# EAGLE design T102 (EAGLE 7.7.0)
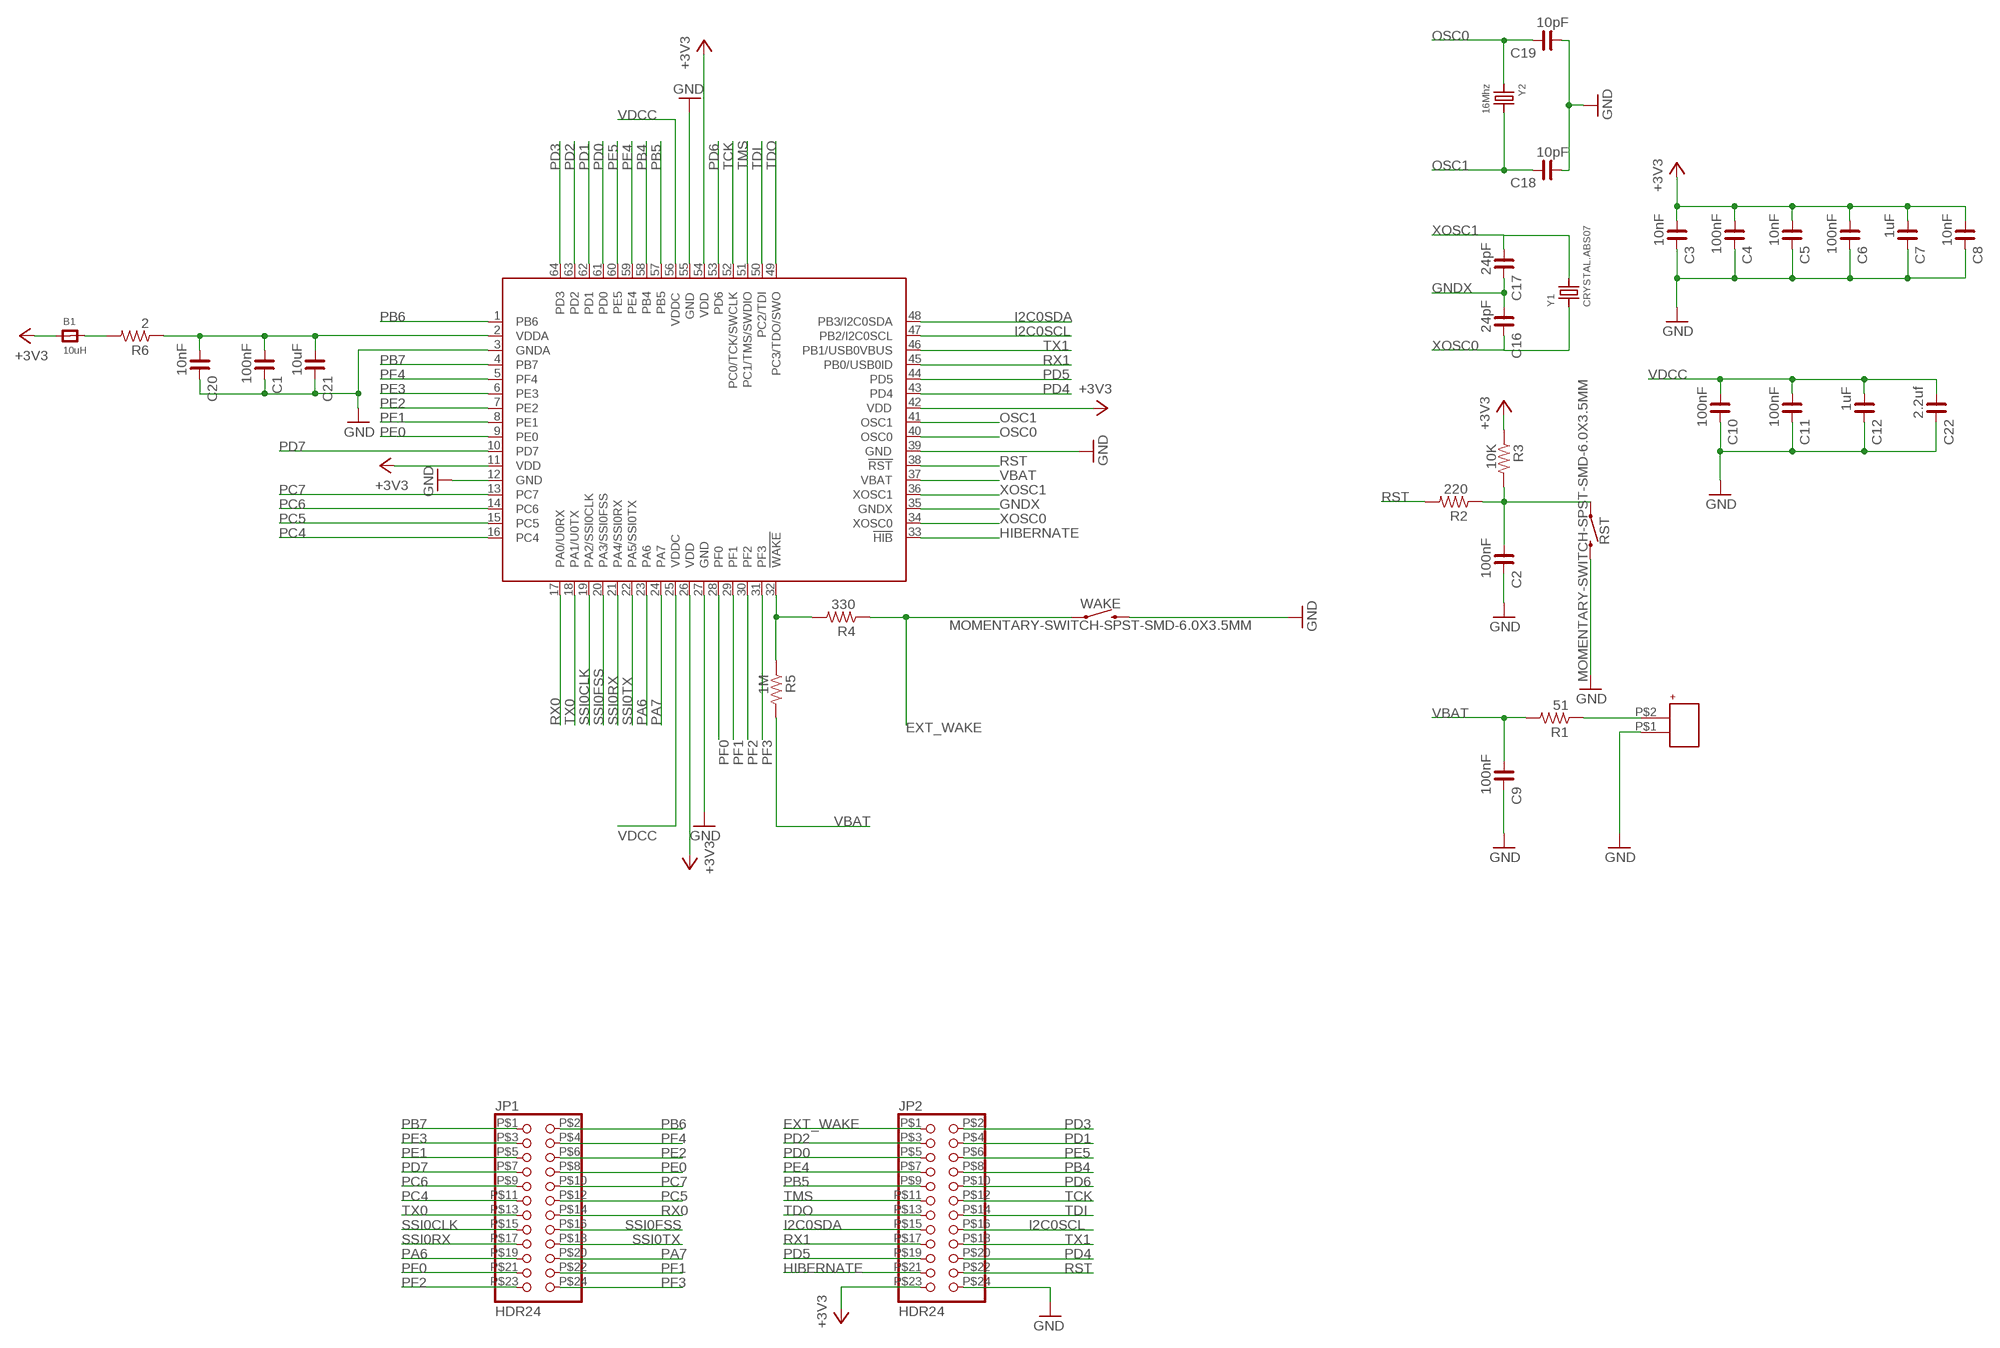
[diagram p0: schematic, sheet 1]

## Parts
B1  10uH  FERRITE_0603  [_0603]
C1  100nF  C_0402  [C0402]
C2  100nF  C_0402  [C0402]
C3  10nF  C_0402  [C0402]
C4  100nF  C_0402  [C0402]
C5  10nF  C_0402  [C0402]
C6  100nF  C_0402  [C0402]
C7  1uF  C_0402  [C0402]
C8  10nF  C_0402  [C0402]
C9  100nF  C_0402  [C0402]
C10  100nF  C_0402  [C0402]
C11  100nF  C_0402  [C0402]
C12  1uF  C_0402  [C0402]
C16  24pF  C_0402  [C0402]
C17  24pF  C_0402  [C0402]
C18  10pF  C_0402  [C0402]
C19  10pF  C_0402  [C0402]
C20  10nF  C_0402  [C0402]
C21  10uF  C_0603  [C0603]
C22  2.2uf  C_0603  [C0603]
IC1  TM4C123[7,G]XXPM  [PM_S-PQFP-G64]
JP1  HDR24  [HDR24]
JP2  HDR24  [HDR24]
R1  51  R_0402  [R0402]
R2  220  R_0402  [R0402]
R3  10K  R_0402  [R0402]
R4  330  R_0402  [R0402]
R5  1M  R_0402  [R0402]
R6  2  R_0402  [R0402]
RST  MOMENTARY-SWITCH-SPST-SMD-6.0X3.5MM  [TACTILE_SWITCH_SMD_6.0X3.5MM]
U$1  JST-MICROBAT  [JST-MICROBAT]
WAKE  MOMENTARY-SWITCH-SPST-SMD-6.0X3.5MM  [TACTILE_SWITCH_SMD_6.0X3.5MM]
Y1  CRYSTAL.ABS07  [ABS07]
Y2  16Mhz  CRYSTAL.6X3.3MM  [6X3.3MM]

## Nets
+3V3: B1.1 C3.1 C4.1 C5.1 C6.1 C7.1 C8.1 IC1.11(VDD) IC1.26(VDD) IC1.42(VDD) IC1.54(VDD) JP2.P$23 R3.1
EXT_WAKE: JP2.P$1 R4.1 WAKE.1
GND: C1.2 C2.2 C3.2 C4.2 C5.2 C6.2 C7.2 C8.2 C9.2 C10.2 C11.2 C12.2 C18.1 C19.1 C20.2 C21.2 C22.2 IC1.3(GNDA) IC1.12(GND) IC1.27(GND) IC1.39(GND) IC1.55(GND) JP2.P$24 RST.2 U$1.P$1 WAKE.2
GNDX: C16.1 C17.2 IC1.35(GNDX)
HIBERNATE: IC1.33(!HIB) JP2.P$21
I2C0SCL: IC1.47(PB2/I2C0SCL) JP2.P$16
I2C0SDA: IC1.48(PB3/I2C0SDA) JP2.P$15
N$1: R1.1 U$1.P$2
N$4: C2.1 R2.1 R3.2 RST.1
N$23: C1.1 C20.1 C21.1 IC1.2(VDDA) R6.1
N$31: B1.2 R6.2
N_WAKE: IC1.32(!WAKE) R4.2 R5.1
OSC0: C19.2 IC1.40(OSC0) Y2.1
OSC1: C18.2 IC1.41(OSC1) Y2.2
PA6: IC1.23(PA6) JP1.P$19
PA7: IC1.24(PA7) JP1.P$20
PB4: IC1.58(PB4) JP2.P$8
PB5: IC1.57(PB5) JP2.P$9
PB6: IC1.1(PB6) JP1.P$2
PB7: IC1.4(PB7) JP1.P$1
PC4: IC1.16(PC4) JP1.P$11
PC5: IC1.15(PC5) JP1.P$12
PC6: IC1.14(PC6) JP1.P$9
PC7: IC1.13(PC7) JP1.P$10
PD0: IC1.61(PD0) JP2.P$5
PD1: IC1.62(PD1) JP2.P$4
PD2: IC1.63(PD2) JP2.P$3
PD3: IC1.64(PD3) JP2.P$2
PD4: IC1.43(PD4) JP2.P$20
PD5: IC1.44(PD5) JP2.P$19
PD6: IC1.53(PD6) JP2.P$10
PD7: IC1.10(PD7) JP1.P$7
PE0: IC1.9(PE0) JP1.P$8
PE1: IC1.8(PE1) JP1.P$5
PE2: IC1.7(PE2) JP1.P$6
PE3: IC1.6(PE3) JP1.P$3
PE4: IC1.59(PE4) JP2.P$7
PE5: IC1.60(PE5) JP2.P$6
PF0: IC1.28(PF0) JP1.P$21
PF1: IC1.29(PF1) JP1.P$22
PF2: IC1.30(PF2) JP1.P$23
PF3: IC1.31(PF3) JP1.P$24
PF4: IC1.5(PF4) JP1.P$4
RST: IC1.38(!RST) JP2.P$22 R2.2
RX0: IC1.17(PA0/U0RX) JP1.P$14
RX1: IC1.45(PB0/USB0ID) JP2.P$17
SSI0CLK: IC1.19(PA2/SSI0CLK) JP1.P$15
SSI0FSS: IC1.20(PA3/SSI0FSS) JP1.P$16
SSI0RX: IC1.21(PA4/SSI0RX) JP1.P$17
SSI0TX: IC1.22(PA5/SSI0TX) JP1.P$18
TCK: IC1.52(PC0/TCK/SWCLK) JP2.P$12
TDI: IC1.50(PC2/TDI) JP2.P$14
TDO: IC1.49(PC3/TDO/SWO) JP2.P$13
TMS: IC1.51(PC1/TMS/SWDIO) JP2.P$11
TX0: IC1.18(PA1/U0TX) JP1.P$13
TX1: IC1.46(PB1/USB0VBUS) JP2.P$18
VBAT: C9.1 IC1.37(VBAT) R1.2 R5.2
VDCC: C10.1 C11.1 C12.1 C22.1 IC1.25(VDDC) IC1.56(VDDC)
XOSC0: C16.2 IC1.34(XOSC0) Y1.1
XOSC1: C17.1 IC1.36(XOSC1) Y1.2

## Library data of the parts
B1 = microbuilder:FERRITE: Ferrite Bead 0603 MMZ1608B121C - 120 Ohm @ 100MHz, 600mA, 0.15 Ohm DC Resistance - Digikey: 445-2164-1-ND BK1608HW121-T - 120 Ohm, 600mA Ferrite Chip - Digikey: 587-1876-2-ND 0805 HZ0805B272R-10 - 2.7K Ohm @ 100MHz, 200mA, 0.8 Ohm DC Resistance - Digikey: 240-2504-1-ND (see also Murata BLM21BD272SN1L) MMZ2012Y152B - 1.5K Ohm @ 100MHz, 500mA, 0.4 Ohm DC Resistance - Digikey: 445-1560-1-ND - Mainly for high frequency (80-400MHz) MMZ2012R102A - 1K Ohm @ 100MHz, 500mA, 0.3 Ohm DC Resistance - Digikey: 445-1555-2-ND - More general purpose (10-200MHz)
C1-C12 C16-C22 = rc-master-smd:C_: NON-POLARIZED CAP
IC1 = ti-tiva:TM4C123[7,G]XX
JP1 JP2 = EAGLE_CAN:HDR24
R1-R6 = rc-master-smd:R_: RESISTOR
RST WAKE = SparkFun-Switches:MOMENTARY-SWITCH-SPST: Momentary Switch (Pushbutton) - SPST Normally-open (NO) SPST momentary switches (buttons, pushbuttons). Variants PTH-12MM - 12mm square, through-hole Momentary Pushbutton Switch - 12mm Square <https://www.sparkfun.com/products/9190> (COM-09190) PTH-6.0MM, PTH-6.0MM-KIT - 6.0mm square, through-hole Mini Pushbutton Switch <https://www.sparkfun.com/products/97> (COM-00097) KIT package intended for soldering kit's - only one side of pads' copper is exposed. PTH-RIGHT-ANGLE-KIT - Right-angle, through-hole Right Angle Tactile Button <https://www.sparkfun.com/products/10791> - Used on SparkFun BigTime Watch Kit <https://www.sparkfun.com/products/11734> SMD-12MM - 12mm square, surface-mount Tactile Button - SMD (12mm) <https://www.sparkfun.com/products/12993> (COM-12993) Used on SparkFun PicoBoard <https://www.sparkfun.com/products/11888> SMD-4.5MM - 4.5mm Square Trackball Switch Used on SparkFun Blackberry Trackballer Breakout <https://www.sparkfun.com/products/13169> SMD-4.6MMX2.8MM - 4.60mm x 2.80mm, surface mount Used on SparkFun SAMD21 Mini Breakout <https://www.sparkfun.com/products/13664> SMD-5.2MM, SMD-5.2-REDUNDANT - 5.2mm square, surface-mount Mini Pushbutton Switch - SMD <https://www.sparkfun.com/products/8720> (COM-08720) Used on Arduino Pro Mini <https://www.sparkfun.com/products/11114> REDUNDANT package connects both switch circuits together SMD-6.0X3.5MM - 6.0 x 3.5mm, surface mount Momentary Reset Switch SMD <https://www.sparkfun.com/products/8229> (COM-08229) SMD-6.2MM-TALL - 6.2mm square, surface mount Tactile Button - SMD (6mm) <https://www.sparkfun.com/products/12992> Used on SparkFun Digital Sandbox <https://www.sparkfun.com/products/12651> SMD-RIGHT-ANGLE - Right-angle, surface mount Used on SparkFun Block for Intel® Edison - Arduino <https://www.sparkfun.com/products/13036>; PROD_ID: SWCH-00815; SF_SKU: COM-08229
U$1 = EAGLE_CAN:JST-MICROBAT
Y1 Y2 = abracon:CRYSTAL

## Board
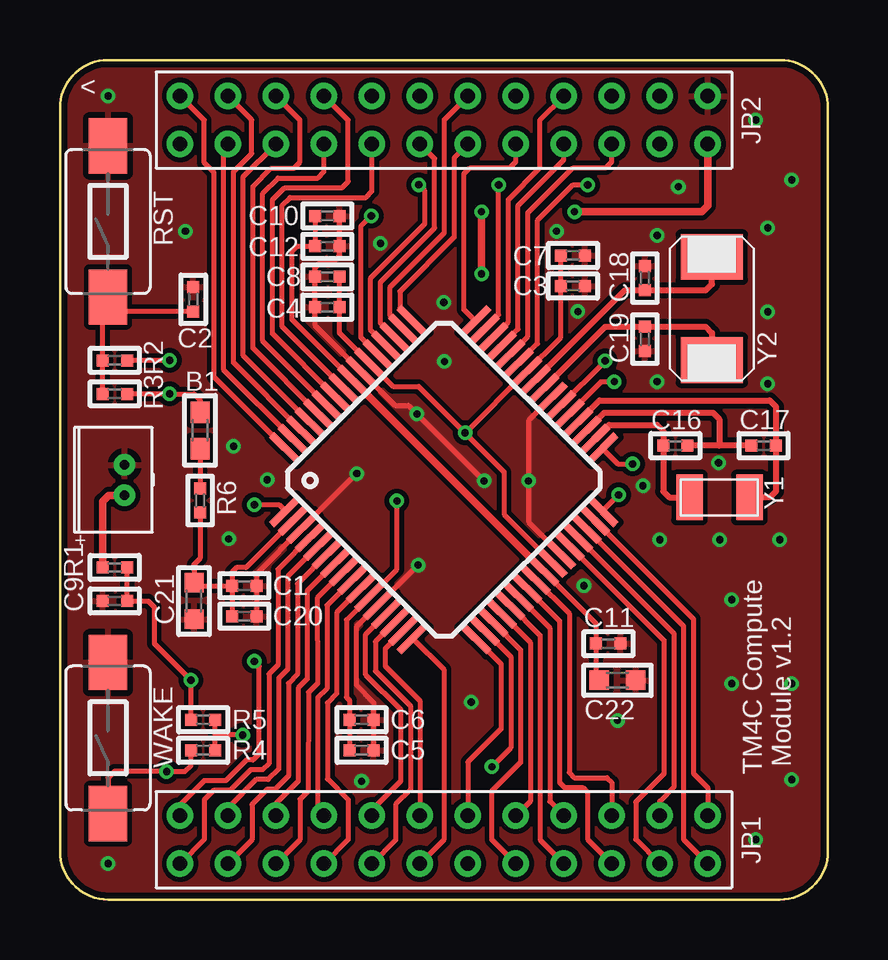
[diagram p1: board, top side]
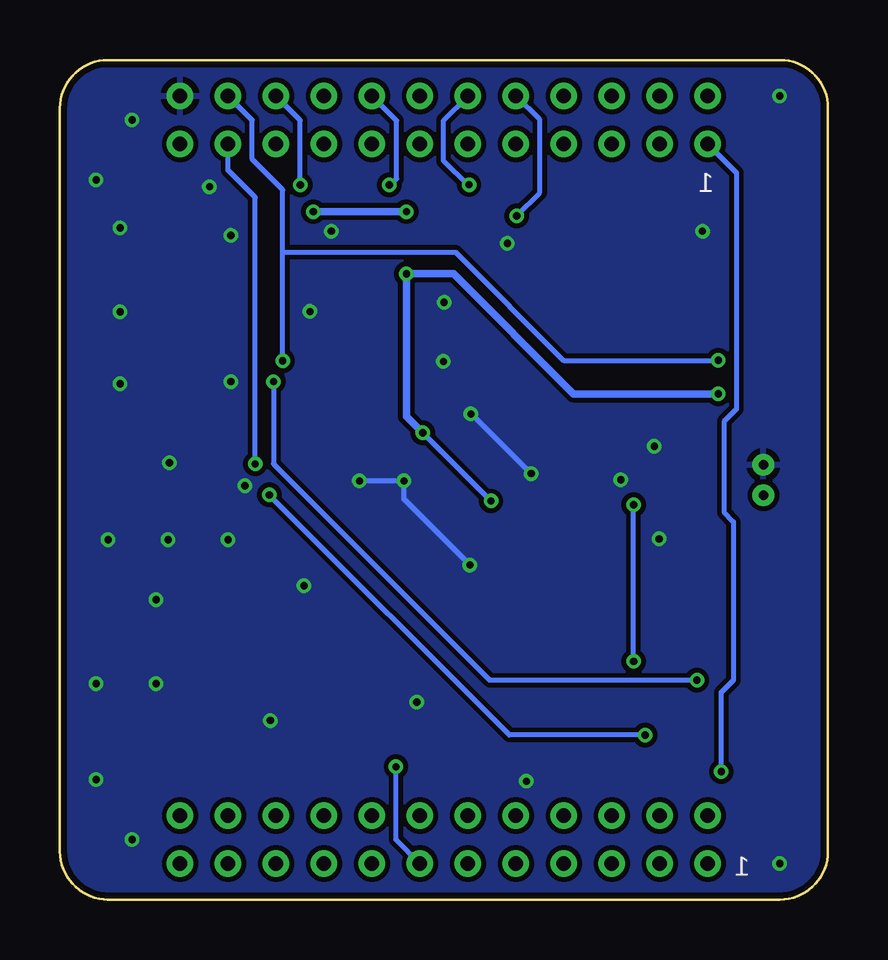
[diagram p2: board, bottom side, seen from below]

Size 32.02 x 35 mm. Coordinates in mm from the lower left corner, seen from the top.
Outline: 0,2 0,33 arc-90 2,35 30.02,35 arc-90 32.02,33 32.02,2 arc-90 30.02,0 2,0 arc-90 0,2
Copper layers (1*16): Top 0.035mm / dielectric 1.5mm / Bottom 0.035mm
Design rules "SeeedStudio_2layer_DRU_no_angle_20140221 *": minimum track width 6mil, minimum drill 12mil, track to track 6mil, track to pad 6mil, pad to pad 6mil, via to via 6mil, smd to smd 0mil, copper to edge 10mil, drill to drill 10mil, minimum pad ring 10mil, minimum via ring 6mil, stop-mask expansion 2mil, vias tented up to drill 12mil, thermal gap 10mil

### Footprints (pad centres in the part's own frame; a part is rotated, then mirrored left to right if it is on the bottom)
_0603 = smd 0.9 x 0.8: 1 -0.762,0; 2 0.762,0
C0402 = smd 0.5 x 0.5: 1 -0.508,0; 2 0.508,0
C0603 = smd 0.8 x 0.8: 1 -0.762,0; 2 0.762,0
PM_S-PQFP-G64 = smd 1.6 x 0.3: 1 -5.6,3.75; 2 -5.6,3.25; 3 -5.6,2.75; 4 -5.6,2.25; 5 -5.6,1.75; 6 -5.6,1.25; 7 -5.6,0.75; 8 -5.6,0.25; 9 -5.6,-0.25; 10 -5.6,-0.75; 11 -5.6,-1.25; 12 -5.6,-1.75; 13 -5.6,-2.25; 14 -5.6,-2.75; 15 -5.6,-3.25; 16 -5.6,-3.75; 33 5.6,-3.75; 34 5.6,-3.25; 35 5.6,-2.75; 36 5.6,-2.25; 37 5.6,-1.75; 38 5.6,-1.25; 39 5.6,-0.75; 40 5.6,-0.25; 41 5.6,0.25; 42 5.6,0.75; 43 5.6,1.25; 44 5.6,1.75; 45 5.6,2.25; 46 5.6,2.75; 47 5.6,3.25; 48 5.6,3.75 | smd 0.3 x 1.6: 17 -3.75,-5.6; 18 -3.25,-5.6; 19 -2.75,-5.6; 20 -2.25,-5.6; 21 -1.75,-5.6; 22 -1.25,-5.6; 23 -0.75,-5.6; 24 -0.25,-5.6; 25 0.25,-5.6; 26 0.75,-5.6; 27 1.25,-5.6; 28 1.75,-5.6; 29 2.25,-5.6; 30 2.75,-5.6; 31 3.25,-5.6; 32 3.75,-5.6; 49 3.75,5.6; 50 3.25,5.6; 51 2.75,5.6; 52 2.25,5.6; 53 1.75,5.6; 54 1.25,5.6; 55 0.75,5.6; 56 0.25,5.6; 57 -0.25,5.6; 58 -0.75,5.6; 59 -1.25,5.6; 60 -1.75,5.6; 61 -2.25,5.6; 62 -2.75,5.6; 63 -3.25,5.6; 64 -3.75,5.6
HDR24 = drill 0.6: P$1 0,0; P$2 0,2; P$3 2,0; P$4 2,2; P$5 4,0; P$6 4,2; P$7 6,0; P$8 6,2; P$9 8,0; P$10 8,2; P$11 10,0; P$12 10,2; P$13 12,0; P$14 12,2; P$15 14,0; P$16 14,2; P$17 16,0; P$18 16,2; P$19 18,0; P$20 18,2; P$21 20,0; P$22 20,2; P$23 22,0; P$24 22,2
R0402 = smd 0.5 x 0.5: 1 -0.508,0; 2 0.508,0
TACTILE_SWITCH_SMD_6.0X3.5MM = smd 2.3 x 1.6: 1 -3.15,0; 2 3.15,0
JST-MICROBAT = drill 0.4: P$1 0,0; P$2 1.27,0
ABS07 = smd 1.1 x 1.9: 1 -1.25,0; 2 1.25,0
6X3.3MM = smd 1.9 x 2.6: 1 -2.15,0; 2 2.15,0

### Placement (x,y rotation side)
B1  5.84,19.56 270 top
C1  7.68,13.08 0 top
C2  5.56,25.02 90 top
C3  21.38,25.58 0 top
C4  11.15,24.69 180 top
C5  12.57,6.22 0 top
C6  12.57,7.49 0 top
C7  21.38,26.85 0 top
C8  11.15,25.96 180 top
C9  2.29,12.45 180 top
C10  11.15,28.5 0 top
C11  22.86,10.67 0 top
C12  11.15,27.23 0 top
C16  25.65,18.92 180 top
C17  29.34,18.92 180 top
C18  24.38,25.91 270 top
C19  24.38,23.37 90 top
C20  7.68,11.81 0 top
C21  5.59,12.45 270 top
C22  23.24,9.14 0 top
IC1  16.01,17.5 45 top
JP1  5.01,1.5 0 top
JP2  5.01,31.5 0 top
R1  2.29,13.84 0 top
R2  2.29,22.48 0 top
R3  2.29,21.08 180 top
R4  5.97,6.22 0 top
R5  5.97,7.49 180 top
R6  5.84,16.64 90 top
RST  2,28.27 90 top
U$1  2.69,18.12 270 top
WAKE  2,6.73 90 top
Y1  27.5,16.76 0 top
Y2  27.18,24.64 90 top

### Tracks (layer width: path | path; a pad name or v marks a point on that pad's centre or on a via)
+3V3  (via drill 0.3)
  Top 0.203: IC1.26 18.51,16.05 18.51,17.83 v16.89,19.46 | v16.89,19.46 14.96,21.39 13.89,21.39 IC1.54 11.66,23.62 C4.1 C8.1 | v16.89,19.46 16.9,19.46 IC1.42 20.88,23.43 C3.1 C7.1 | v14.05,16.62 14.05,13.77 IC1.11 11.94,11.66 11.94,8.43 12.07,8.31 C6.1 C5.1 | B1.1 5.84,20.83 5.59,21.08 v4.57,21.08 R3.1
  Top 0.305: v17.57,28.68 v17.57,26.09 | v21.45,28.68 26.75,28.68 27.01,28.93 JP2.P$23
  Bottom 0.203: v14.05,16.62 v16.89,19.46
  Bottom 0.305: v17.57,28.68 v21.45,28.68 | v16.89,19.46 17.57,20.14 v17.57,26.09 15.62,26.09 10.61,21.08 v4.57,21.08
EXT_WAKE  (via drill 0.3)
  Top 0.203: WAKE.1 2,5.08 2.25,5.33 v4.45,5.33 5.21,5.33 5.46,5.59 R4.1
  Bottom 0.203: JP2.P$1 3.81,30.3 3.81,20.45 4.32,19.94 4.32,16.13 3.94,15.75 3.94,9.14 4.45,8.64 v4.45,5.33
GND  (via drill 0.3)
  Top 0.203: C10.2 C12.2 11.66,26.85 11.4,26.6 10.89,26.6 10.64,26.34 C8.2 C4.2 10.64,23.93 IC1.55 13.97,20.6 14.53,20.6 v14.88,20.24 v17.68,17.45 | C20.2 C1.2 8.19,13.57 IC1.3 v12.37,17.75 | IC1.39 19.53,19.96 v19.53,17.45 19.53,15.74 IC1.27 | v14.93,13.95 IC1.12 12.34,11.36 12.34,8.94 13.08,8.2 C6.2 C5.2
  Bottom 0.203: v19.53,17.45 v17.68,17.45 17.68,16.7 v14.93,13.95 | v12.37,17.75 14.86,20.24 v14.88,20.24
  other vias: 16,24.89 8.64,17.5 24.31,17.25 17.14,8.23 23.24,7.47 16.03,22.43 5.23,27.86 13.36,27.36 24.89,27.69 24.89,21.59 29.51,21.5 20.7,27.86 29.51,24.5 29.51,28 27.51,15 25.01,15 30.51,5 28.01,12.5 25.78,29.72 30.51,30 28.01,9 21.84,13.08 12.57,4.93 7.24,18.9 7.04,15.04 2.01,33.5 2.01,1.5 30.51,9 30.01,15 27.46,18.21 21.59,24.51 29.01,32.5 29.01,2.5
  pour Bottom (isolate 0.203): 0,2 0,33 arc-90 2,35 30.02,35 arc-90 32.02,33 32.02,2 arc-90 30.02,0 2,0 arc-90
  pour Top (isolate 0.203): 0,2 0,33 arc-90 2,35 30.02,35 arc-90 32.02,33 32.02,2 arc-90 30.02,0 2,0 arc-90
GNDX
  Top 0.254: IC1.35 22.69,20.3 27.23,20.3 27.48,20.04 27.48,18.92 | C17.2 27.48,18.92 | 27.48,18.92 C16.1
HIBERNATE  (via drill 0.3)
  Top 0.203: IC1.33 23.27,18.16 v23.88,18.16
  Bottom 0.203: v23.88,18.16 23.88,29.27 25.01,30.41 JP2.P$21
I2C0SCL  (via drill 0.3)
  Top 0.203: IC1.47 18.29,24.38 v18.29,29.79
  Bottom 0.203: v18.29,29.79 18.24,29.79 17.98,30.05 17.98,32.48 JP2.P$16
I2C0SDA
  Top 0.203: IC1.48 16.84,24.59 16.84,30.25 17.09,30.5 18.75,30.5 19.01,30.76 JP2.P$15
N$1
  Top 0.305: R1.1 1.78,16.6 2.03,16.85 U$1.P$2
N$4
  Top 0.203: RST.1 2.03,25.09 2.03,24.51 2.16,24.51 | C2.1 2.16,24.51 | R3.2 R2.1 1.78,24.13 2.16,24.51
N$23
  Top 0.203: C1.1 C20.1 | C1.1 5.84,13.08 C21.1 5.59,13.97 5.84,14.22 R6.1 | IC1.2 7.75,13.84 7.37,13.84 7.18,13.65 C1.1
N$31
  Top 0.203: B1.2 R6.2
N_WAKE  (via drill 0.3)
  Top 0.203: v23.29,16.87 v23.29,16.86 IC1.32 | R4.2 6.48,6.86 | 6.48,6.86 R5.1 | v7.62,6.86 6.48,6.86
  Bottom 0.203: v23.29,16.87 v23.29,16.86 13.29,6.86 v7.62,6.86
OSC0
  Top 0.254: Y2.1 27.18,23.62 26.92,23.88 C19.2 22.74,23.88 IC1.40
OSC1
  Top 0.254: Y2.2 27.18,25.65 26.92,25.4 C18.2 23.55,25.4 IC1.41
PA6
  Top 0.203: IC1.23 20.83,11.62 20.83,4.88 21.03,4.67 21.79,4.67 21.99,4.47 21.99,2.51 JP1.P$19
PA7
  Top 0.203: IC1.24 21.23,11.92 21.23,5.28 21.44,5.08 22.8,5.08 23.01,4.88 JP1.P$20
PB4
  Top 0.203: JP2.P$8 12.01,32.5 12.01,29.93 11.76,29.68 9.37,29.68 8.86,29.17 8.86,23.58 IC1.58
PB5
  Top 0.203: JP2.P$9 13.01,29.52 12.75,29.27 9.59,29.27 9.27,28.95 9.27,23.89 IC1.57
PB6  (via drill 0.3)
  Top 0.203: JP1.P$2 5.01,3.95 6.01,4.95 6.91,4.95 7.77,5.82 8.05,5.82 8.31,6.07 8.31,9.73 v8.1,9.93 | v8.1,16.46 9.13,16.46 IC1.1
  Bottom 0.203: v8.1,9.93 v8.1,16.46
PB7
  Top 0.203: IC1.4 9.09,13.77 9.09,9.78 8.71,9.4 8.71,5.66 8.46,5.41 7.95,5.41 7.09,4.55 6.4,4.55 6.02,4.17 6.02,2.51 JP1.P$1
PC4
  Top 0.203: IC1.16 16,9.59 16,2.49 JP1.P$11
PC5
  Top 0.203: IC1.15 13.56,10.46 13.56,9.73 15.01,8.28 JP1.P$12
PC6
  Top 0.203: IC1.14 13.16,10.76 13.16,9.53 14.61,8.08 14.61,4.57 13.99,3.96 13.99,2.48 JP1.P$9
PC7
  Top 0.203: IC1.13 12.75,11.06 12.75,9.37 14.2,7.92 14.2,4.93 13.01,3.74 JP1.P$10
PD0
  Top 0.203: IC1.61 7.64,22.68 7.64,30.14 JP2.P$5
PD1
  Top 0.203: JP2.P$4 8,32.51 8,31.1 7.24,30.34 7.24,22.38 IC1.62
PD2
  Top 0.203: IC1.63 6.83,22.08 6.83,31.32 JP2.P$3
PD3
  Top 0.203: IC1.64 6.42,21.78 6.42,30.31 6.02,30.71 6.02,32.5 JP2.P$2
PD4  (via drill 0.3)
  Top 0.203: IC1.43 19.91,23.17 19.91,28.32 21.39,29.79 v22,29.79
  Bottom 0.203: v22,29.79 22,32.49 JP2.P$20
PD5
  Top 0.203: IC1.44 19.51,23.47 19.51,28.63 21.39,30.5 22.75,30.5 23.01,30.76 JP2.P$19
PD6  (via drill 0.3)
  Top 0.203: IC1.53 12.55,23.44 12.55,28.07 v12.98,28.5
  Bottom 0.203: JP2.P$10 12.01,32.5 12.01,29.47 v12.98,28.5
PD7
  Top 0.203: IC1.10 11.53,11.96 11.53,8.59 11.15,8.2 11.15,5.03 12.01,4.17 12.01,2.51 JP1.P$7
PE0
  Top 0.203: IC1.9 11.12,12.26 11.12,8.79 10.74,8.41 10.74,3.76 JP1.P$8
PE1
  Top 0.203: JP1.P$5 10,2.5 10,4.19 10.34,4.52 10.36,8.64 10.74,9.02 10.72,12.56 IC1.8
PE2
  Top 0.203: IC1.7 10.31,12.87 10.31,9.2 9.93,8.81 9.93,4.93 9.01,4 JP1.P$6
PE3
  Top 0.203: IC1.6 9.91,13.17 9.91,9.4 9.52,9.02 9.52,5.16 8.97,4.6 8.64,4.6 8,3.96 8,2.49 JP1.P$3
PE4
  Top 0.203: JP2.P$7 11.01,30.34 10.75,30.08 9.09,30.08 8.46,29.45 8.46,23.28 IC1.59
PE5
  Top 0.203: JP2.P$6 10,32.49 10,30.74 9.75,30.49 8.81,30.49 8.05,29.73 8.05,22.98 IC1.60
PF0
  Top 0.203: IC1.28 25.2,10.79 25.2,5.26 24,4.06 24,2.51 JP1.P$21
PF1
  Top 0.203: IC1.29 25.6,11.09 25.6,4.7 25.01,4.1 JP1.P$22
PF2
  Top 0.203: JP1.P$23 26.01,2.5 26.01,11.39 IC1.30
PF3
  Top 0.203: IC1.31 26.42,11.69 26.42,5.26 27.01,4.67 JP1.P$24
PF4
  Top 0.203: IC1.5 9.5,13.47 9.5,9.6 9.12,9.22 9.12,5.44 8.69,5 8.18,5 7.01,3.83 JP1.P$4
RST  (via drill 0.3)
  Top 0.203: v4.57,22.48 R2.2 | IC1.38 v22.73,22.46
  Bottom 0.203: 24,32.49 JP2.P$22 | 22.73,26.98 15.52,26.98 11.02,22.48 v4.57,22.48 | v22.73,22.46 22.73,26.98 | 24,32.49 | 22.73,26.98 22.73,29.59 24,30.86 24,32.49
RX0
  Top 0.203: IC1.17 18.39,9.81 18.39,7.11 17.01,5.73 JP1.P$14
RX1
  Top 0.203: IC1.45 19.1,23.77 19.1,28.93 21.01,30.84 JP2.P$17
SSI0CLK
  Top 0.203: IC1.19 19.2,10.42 19.2,5.71 18.01,4.52 18.01,2.5 JP1.P$15
SSI0FSS
  Top 0.203: IC1.20 19.61,10.72 19.61,4.1 JP1.P$16
SSI0RX
  Top 0.203: IC1.21 20.01,11.02 20.01,2.49 JP1.P$17
SSI0TX
  Top 0.203: IC1.22 20.42,11.32 20.42,4.09 JP1.P$18
TCK  (via drill 0.3)
  Top 0.203: IC1.52 12.95,23.74 12.95,25.91 15.21,28.17 15.21,29.55 v14.96,29.8
  Bottom 0.203: JP2.P$12 16.03,32.48 16.03,30.79 15.04,29.8 v14.96,29.8
TDI
  Top 0.203: JP2.P$14 16.03,32.52 16.03,27.79 13.77,25.53 13.77,24.34 IC1.50
TDO
  Top 0.203: JP2.P$13 16.43,30.92 16.43,27.61 14.17,25.35 14.17,24.64 IC1.49
TMS
  Top 0.203: JP2.P$11 15.62,30.89 15.62,28 13.36,25.73 13.36,24.04 IC1.51
TX0  (via drill 0.3)
  Top 0.203: IC1.18 18.8,10.12 18.8,6.33 v18.01,5.54
  Bottom 0.203: JP1.P$13 18.01,2.5 v18.01,5.54
TX1
  Top 0.203: IC1.46 18.69,24.07 18.69,29.19 20.02,30.51 20.02,32.51 JP2.P$18
VBAT  (via drill 0.3)
  Top 0.203: IC1.37 22.57,21.59 v23.11,21.59 | R5.2 v5.46,9.14 3.94,10.67 3.94,12.19 3.68,12.45 C9.1 R1.2
  Bottom 0.203: v5.46,9.14 14.1,9.14 23.11,18.16 v23.11,21.59
VDCC
  Top 0.203: C10.1 C12.1 9.88,27.23 9.68,27.03 9.68,24.19 IC1.56 | IC1.25 22.35,11.51 C11.1 22.35,9.27 C22.1
  Top 0.305: IC1.56 IC1.25
XOSC0
  Top 0.254: IC1.34 22.89,19.79 24.89,19.79 25.15,19.53 C16.2 25.15,17.02 25.4,16.76 Y1.1
XOSC1
  Top 0.254: IC1.36 22.49,20.8 29.59,20.8 29.84,20.55 C17.1 29.84,17.02 29.59,16.76 Y1.2

### Text on the board
tPlace: > | TM4C Compute / Module v1.2
bPlace: 1 | 1